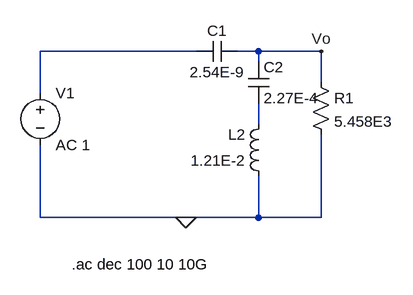
[diagram p0: schematic Draft2.asc]
Draft2.asc, the LTspice schematic file:
Version 4.1
SHEET 1 880 680
WIRE 224 80 -16 80
WIRE 320 80 288 80
WIRE 416 80 320 80
WIRE 320 96 320 80
WIRE 416 128 416 80
WIRE -16 144 -16 80
WIRE 320 192 320 160
WIRE -16 336 -16 224
WIRE 208 336 -16 336
WIRE 320 336 320 272
WIRE 320 336 208 336
WIRE 416 336 416 208
WIRE 416 336 320 336
FLAG 416 80 Vo
FLAG 208 336 0
SYMBOL voltage -16 128 R0
SYMATTR InstName V1
SYMATTR Value AC 1
SYMBOL cap 288 64 R90
WINDOW 0 0 32 VBottom 2
WINDOW 3 32 32 VTop 2
SYMATTR InstName C1
SYMATTR Value 2.54E-9
SYMBOL cap 304 96 R0
SYMATTR InstName C2
SYMATTR Value 2.27E-4
SYMBOL res 400 112 R0
SYMATTR InstName R1
SYMATTR Value 5.458E3
SYMBOL ind 336 288 R180
WINDOW 0 36 80 Left 2
WINDOW 3 36 40 Left 2
SYMATTR InstName L2
SYMATTR Value 1.21E-2
TEXT 32 408 Left 2 !.ac dec 100 10 10G

The netlist it stands for:
* Draft2.asc
V1 N001 0 AC 1
C1 Vo N001 2.54E-9
C2 Vo N002 2.27E-4
R1 Vo 0 5.458E3
L2 0 N002 1.21E-2
.ac dec 100 10 10G
.backanno
.end